# Altium schematic sheet Sheet2.SchDoc
size A; SheetNumber: 1; SheetTotal: 1
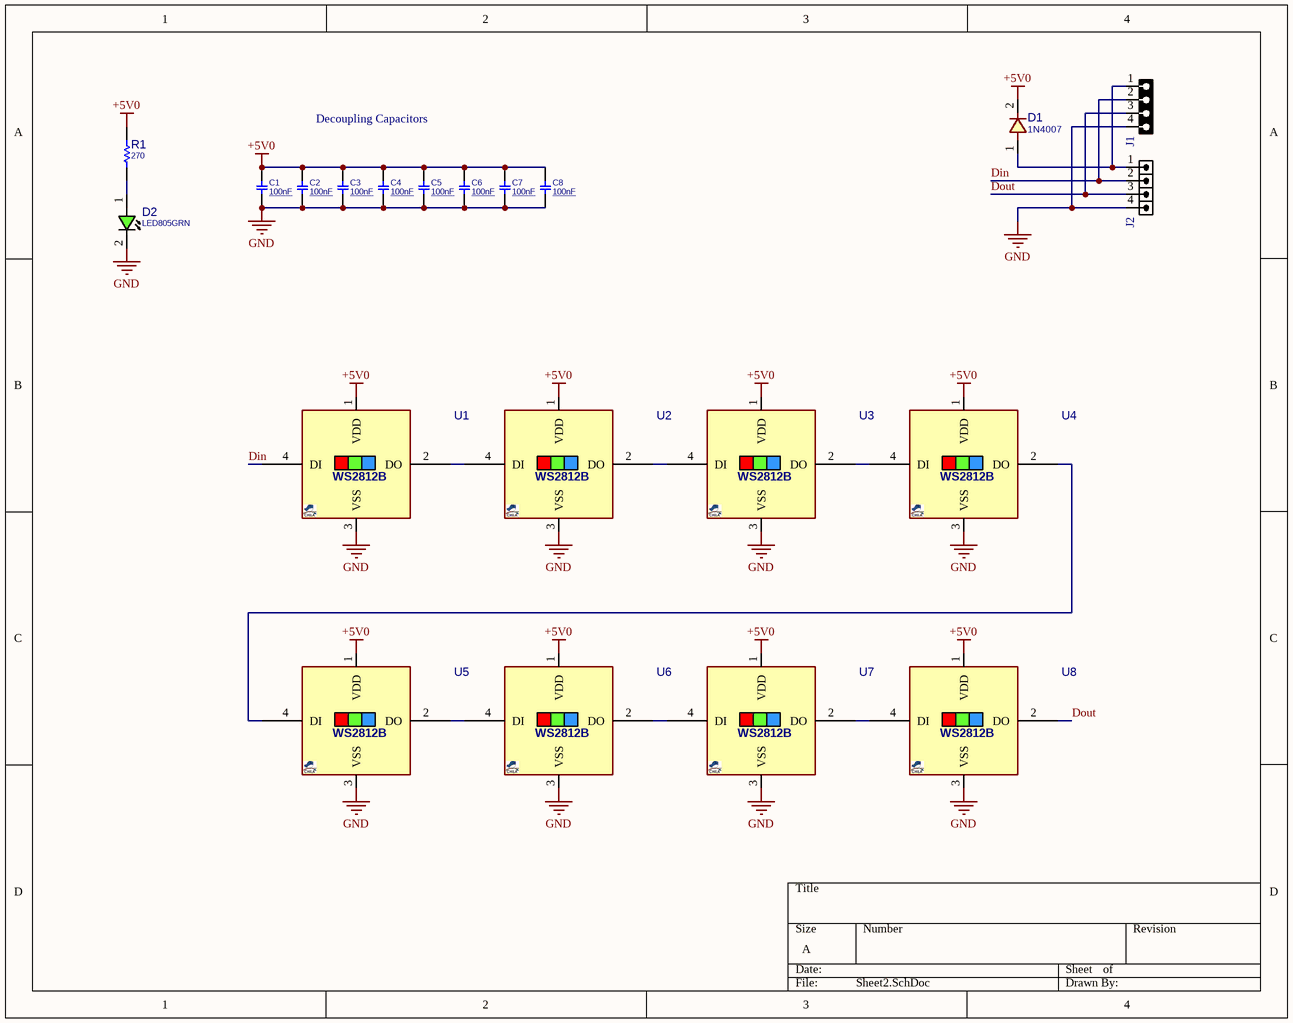
[diagram p0: Sheet2.SchDoc]

## Parts
C1  100nF  [C0805]
C2  100nF  [C0805]
C3  100nF  [C0805]
C4  100nF  [C0805]
C5  100nF  [C0805]
C6  100nF  [C0805]
C7  100nF  [C0805]
C8  100nF  [C0805]
D1  1N4007  [D_SMA]
D2  LED805GRN  [LED0805GRN]
J1  HDRF4  [HDR_F_1X4]  (value not drawn)
J2  HDR1X4  [HDR_M_1X4]  (value not drawn)
R1  270  [R0805]
U1  WS2812B-B  [LED5050RGB_4]  (value not drawn)
U2  WS2812B-B  [LED5050RGB_4]  (value not drawn)
U3  WS2812B-B  [LED5050RGB_4]  (value not drawn)
U4  WS2812B-B  [LED5050RGB_4]  (value not drawn)
U5  WS2812B-B  [LED5050RGB_4]  (value not drawn)
U6  WS2812B-B  [LED5050RGB_4]  (value not drawn)
U7  WS2812B-B  [LED5050RGB_4]  (value not drawn)
U8  WS2812B-B  [LED5050RGB_4]  (value not drawn)

## Nets
+5V0: C1.1 C2.1 C3.1 C4.1 C5.1 C6.1 C7.1 C8.1 D1.2 R1.2 U1.1(VDD) U2.1(VDD) U3.1(VDD) U4.1(VDD) U5.1(VDD) U6.1(VDD) U7.1(VDD) U8.1(VDD)
GND: C1.2 C2.2 C3.2 C4.2 C5.2 C6.2 C7.2 C8.2 D2.2(CATHODE) J1.4 J2.4 U1.3(VSS) U2.3(VSS) U3.3(VSS) U4.3(VSS) U5.3(VSS) U6.3(VSS) U7.3(VSS) U8.3(VSS)
Din: J1.2 J2.2 U1.4(DI)
Dout: J1.3 J2.3 U8.2(DO)
NetD1_1: D1.1 J1.1 J2.1
NetD2_1: D2.1(ANODE) R1.1
NetU1_2: U1.2(DO) U2.4(DI)
NetU2_2: U2.2(DO) U3.4(DI)
NetU3_2: U3.2(DO) U4.4(DI)
NetU4_2: U4.2(DO) U5.4(DI)
NetU5_2: U5.2(DO) U6.4(DI)
NetU6_2: U6.2(DO) U7.4(DI)
NetU7_2: U7.2(DO) U8.4(DI)

## Notes on the sheet
- Decoupling Capacitors
- (in symbol WS2812B-B_5050_4L) WS2812B

## Library data of the parts
C1-C8 = CAP_SMD_MLCC_0805: CAP, MLCC, -F, -V, MATERIAL, -%, 0201; PARAM: -, -%; MANF_P#: MANF_PART#; PRICE: 100= 1$; MANF: -; PARAM2: -V; ASSEMBLY: ASSEMBLY; VALUE: 100nF
D1 = DIODE_SMD_1N4007: DIODE, GENERAL PURPOSE, 1000V/1A; MANF: Kingtronics; DESC: DESCRIPTION; PARAM: 1000V VRRM; PARAM2: 1A; MANF_P#: M7; ASSEMBLY: ASSEMBLY; PRICE: PRICE; VALUE: 1N4007
D2 = LED_SMD_0805_GRN: LED, SMD, 0805, GREEN; PARAM: 20mA; DESC: DESCRIPTION; PARAM2: 2.2V; MANF: -; ASSEMBLY: ASSEMBLY; PRICE: 36t@Javan; MANF_P#: -; VALUE: LED805GRN
J1 = HDR_F_1X4: CONN, HEADER, Female, pitch: 2.54mm, 4POS; VALUE: HDRF4
J2 = HDR_M_1X4: CONN, HEADER, Male, pitch: 2.54mm, 4POS; VALUE: HDRM4
R1 = RES_SMD: RESISTOR, SMD; PARAM: -W; DESC: DESCRIPTION; DIST#: MOUSER; PARAM2: 1%; MANF_P#: -; MANF: -; ASSEMBLY: ASSEMBLY; PRICE: 100= 0.5$; VALUE: 270
U1-U8 = WS2812B-B_5050_4L: LED, SMD, RGB with WS2812 4Lead; MANF: Worldsemi; PARAM: 18mA, 2KHz/s, 800Kbps; DESC: DESCRIPTION; PARAM2: 3.7~5.3v, -25~80oC; MANF_P#: WS2812B-B; ASSEMBLY: ASSEMBLY; PRICE: -; VALUE: WS2812B-B